# EAGLE design Project_bird_V2.1 (EAGLE 9.6.2)

## Sheet 1 of 2
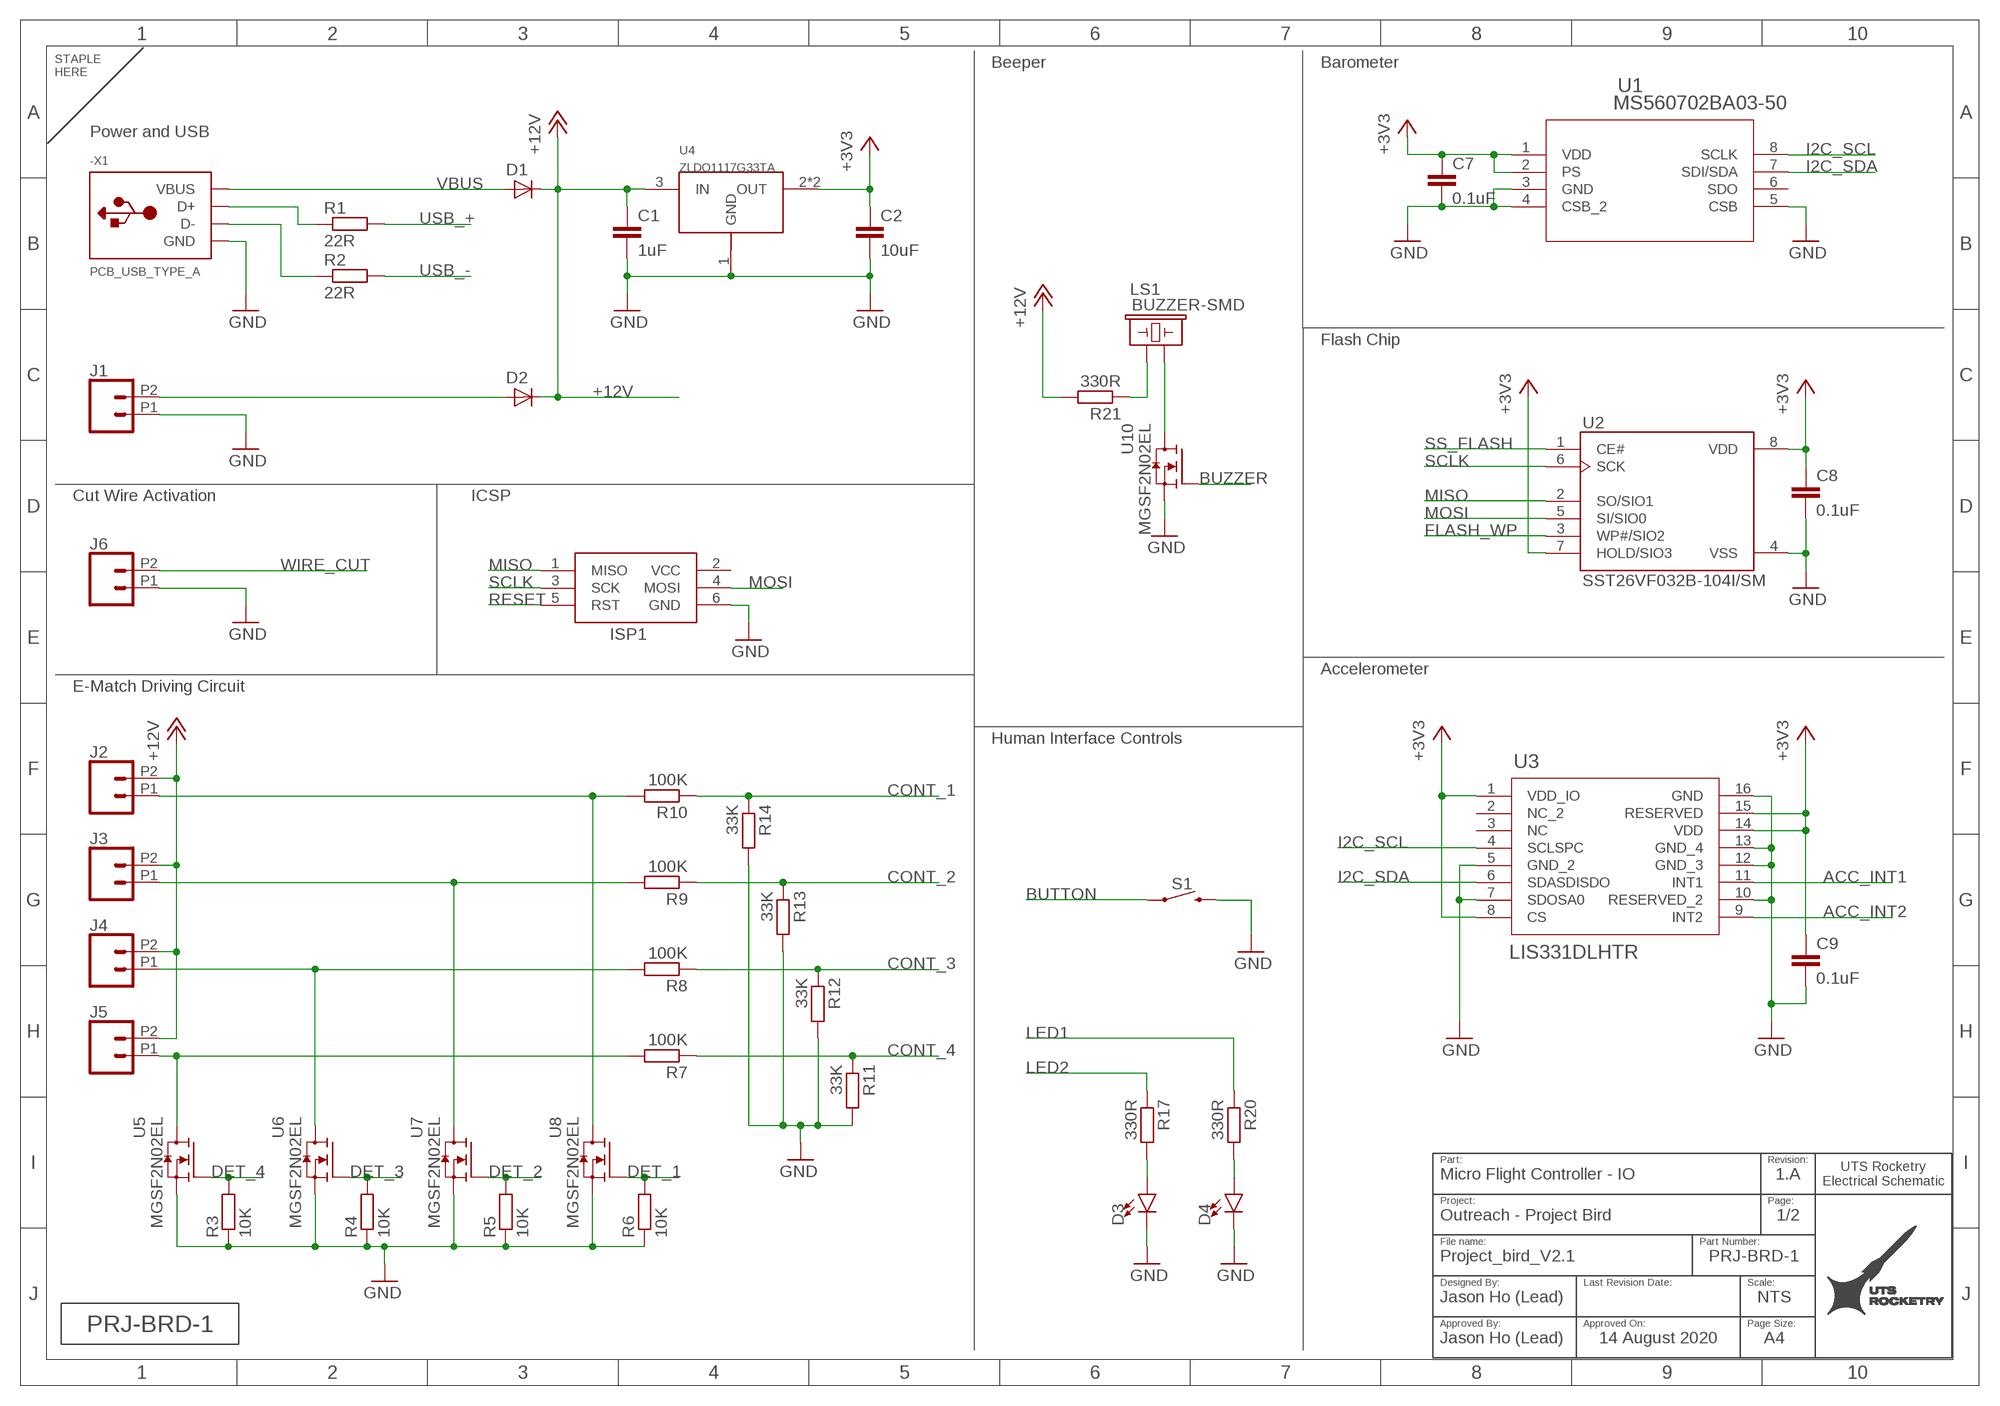
[diagram p0: schematic, sheet 1]
U$1 (TITLE_BLOCK_PAGE_TEMPLATE_A4): APPROVER: Jason Ho (Lead); APPROVE_DATE: 14 August 2020; DESIGNER: Jason Ho (Lead); PART_NAME: Micro Flight Controller - IO; PART_NO: PRJ-BRD-1; PG_SIZE: A4; PROJECT_NAME: Outreach - Project Bird; REV: 1.A; SCALE: NTS

### Parts
-X1  PCB_USB_TYPE_A  [USB_TYPE-A]
C1  1uF  CAP_0805  [C0805K]
C2  10uF  CAP_0805  [C0805K]
C7  0.1uF  CAP_0805  [C0805K]
C8  0.1uF  CAP_0805  [C0805K]
C9  0.1uF  CAP_0805  [C0805K]
D1  1A  DIODESOD-323F  [SOD-323F]
D2  1A  DIODESOD-323F  [SOD-323F]
D3  LED3MM-RED  [LED_3MM]
D4  LED3MM-YELLOW  [LED_3MM]
ISP1  AVRISP-6  [AVRISP]
J1  CONN_022.54MM_SCREWTERM  [1X02_2.54_SCREWTERM]
J2  CONN_022.54MM_SCREWTERM  [1X02_2.54_SCREWTERM]
J3  CONN_022.54MM_SCREWTERM  [1X02_2.54_SCREWTERM]
J4  CONN_022.54MM_SCREWTERM  [1X02_2.54_SCREWTERM]
J5  CONN_022.54MM_SCREWTERM  [1X02_2.54_SCREWTERM]
J6  CONN_022.54MM_SCREWTERM  [1X02_2.54_SCREWTERM]
LS1  BUZZER-SMD  [BUZZER-CCV]
R1  22R  RES_0805  [R0805]
R2  22R  RES_0805  [R0805]
R3  10K  RES_0805  [R0805]
R4  10K  RES_0805  [R0805]
R5  10K  RES_0805  [R0805]
R6  10K  RES_0805  [R0805]
R7  100K  RES_0805  [R0805]
R8  100K  RES_0805  [R0805]
R9  100K  RES_0805  [R0805]
R10  100K  RES_0805  [R0805]
R11  33K  RES_0805  [R0805]
R12  33K  RES_0805  [R0805]
R13  33K  RES_0805  [R0805]
R14  33K  RES_0805  [R0805]
R17  330R  RES_0805  [R0805]
R20  330R  RES_0805  [R0805]
R21  330R  RES_0805  [R0805]
S1  MOMENTARY-SWITCH-SPST  [TACTILE_SWITCH_PTH_6.0MM]
U1  MS560702BA03-50  [SON8_MS5611]
U2  SST26VF032B-104I/SM  [SOIC127P794X203-8N]
U3  LIS331DLHTR  [LGA-16_3X3X1MM]
U4  ZLDO1117G33TA  [SOT223]
U5  MGSF2N02EL  [SOT-23-3]
U6  MGSF2N02EL  [SOT-23-3]
U7  MGSF2N02EL  [SOT-23-3]
U8  MGSF2N02EL  [SOT-23-3]
U10  MGSF2N02EL  [SOT-23-3]

### Nets
+3V3: C2.1 C7.1 C8.1 C9.1 U1.1(VDD) U1.2(PS) U2.7(HOLD/SIO3) U2.8(VDD) U3.1(VDD_IO) U3.8(CS) U3.14(VDD) U3.15(RESERVED) U4.2(OUT) U4.4(OUT) ; also sheet 2
+12V: C1.1 D1.C D2.C J2.P2 J3.P2 J4.P2 J5.P2 R21.2 U4.3(IN)
ACC_INT1: U3.11(INT1) ; also sheet 2
ACC_INT2: U3.9(INT2) ; also sheet 2
BUTTON: S1.1 S1.2 ; also sheet 2
BUZZER: U10.1(G) ; also sheet 2
CONT_1: R10.1 R14.1 ; also sheet 2
CONT_2: R9.1 R13.1 ; also sheet 2
CONT_3: R8.1 R12.1 ; also sheet 2
CONT_4: R7.1 R11.1 ; also sheet 2
DET_1: R6.2 U8.1(G) ; also sheet 2
DET_2: R5.2 U7.1(G) ; also sheet 2
DET_3: R4.2 U6.1(G) ; also sheet 2
DET_4: R3.2 U5.1(G) ; also sheet 2
FLASH_WP: U2.3(WP#/SIO2) ; also sheet 2
GND: -X1.GND C1.2 C2.2 C7.2 C8.2 C9.2 D3.K(C) D4.K(C) ISP1.6(GND) J1.P1 J6.P1 R3.1 R4.1 R5.1 R6.1 R11.2 R12.2 R13.2 R14.2 S1.3 S1.4 U1.3(GND) U1.4(CSB_2) U1.5(CSB) U2.4(VSS) U3.5(GND_2) U3.7(SDOSA0) U3.10(RESERVED_2) U3.12(GND_3) U3.13(GND_4) U3.16(GND) U4.1(GND) U5.2(S) U6.2(S) U7.2(S) U8.2(S) U10.2(S) ; also sheet 2
I2C_SCL: U1.8(SCLK) U3.4(SCLSPC) ; also sheet 2
I2C_SDA: U1.7(SDI/SDA) U3.6(SDASDISDO) ; also sheet 2
LED1: R20.1 ; also sheet 2
LED2: R17.1 ; also sheet 2
MISO: ISP1.1(MISO) U2.2(SO/SIO1) ; also sheet 2
MOSI: ISP1.4(MOSI) U2.5(SI/SIO0) ; also sheet 2
N$1: D2.A J1.P2
N$2: D3.A R17.2
N$3: -X1.D+ R1.1
N$4: D4.A R20.2
N$5: -X1.D- R2.1
N$6: LS1.- U10.3(D)
N$7: LS1.+ R21.1
N$10: J5.P1 R7.2 U5.3(D)
N$11: J4.P1 R8.2 U6.3(D)
N$12: J3.P1 R9.2 U7.3(D)
N$13: J2.P1 R10.2 U8.3(D)
RESET: ISP1.5(RST) ; also sheet 2
SCLK: ISP1.3(SCK) U2.6(SCK) ; also sheet 2
SS_FLASH: U2.1(CE#) ; also sheet 2
USB_+: R1.2 ; also sheet 2
USB_-: R2.2 ; also sheet 2
VBUS: -X1.VBUS D1.A ; also sheet 2
WIRE_CUT: J6.P2 ; also sheet 2
Unconnected: U1.6(SDO) U3.2(NC_2) U3.3(NC)

### Notes on the sheet
- Beeper | Barometer
- Power and USB
- Flash Chip
- Cut Wire Activation | ICSP
- Accelerometer
- E-Match Driving Circuit
- Human Interface Controls

## Sheet 2 of 2
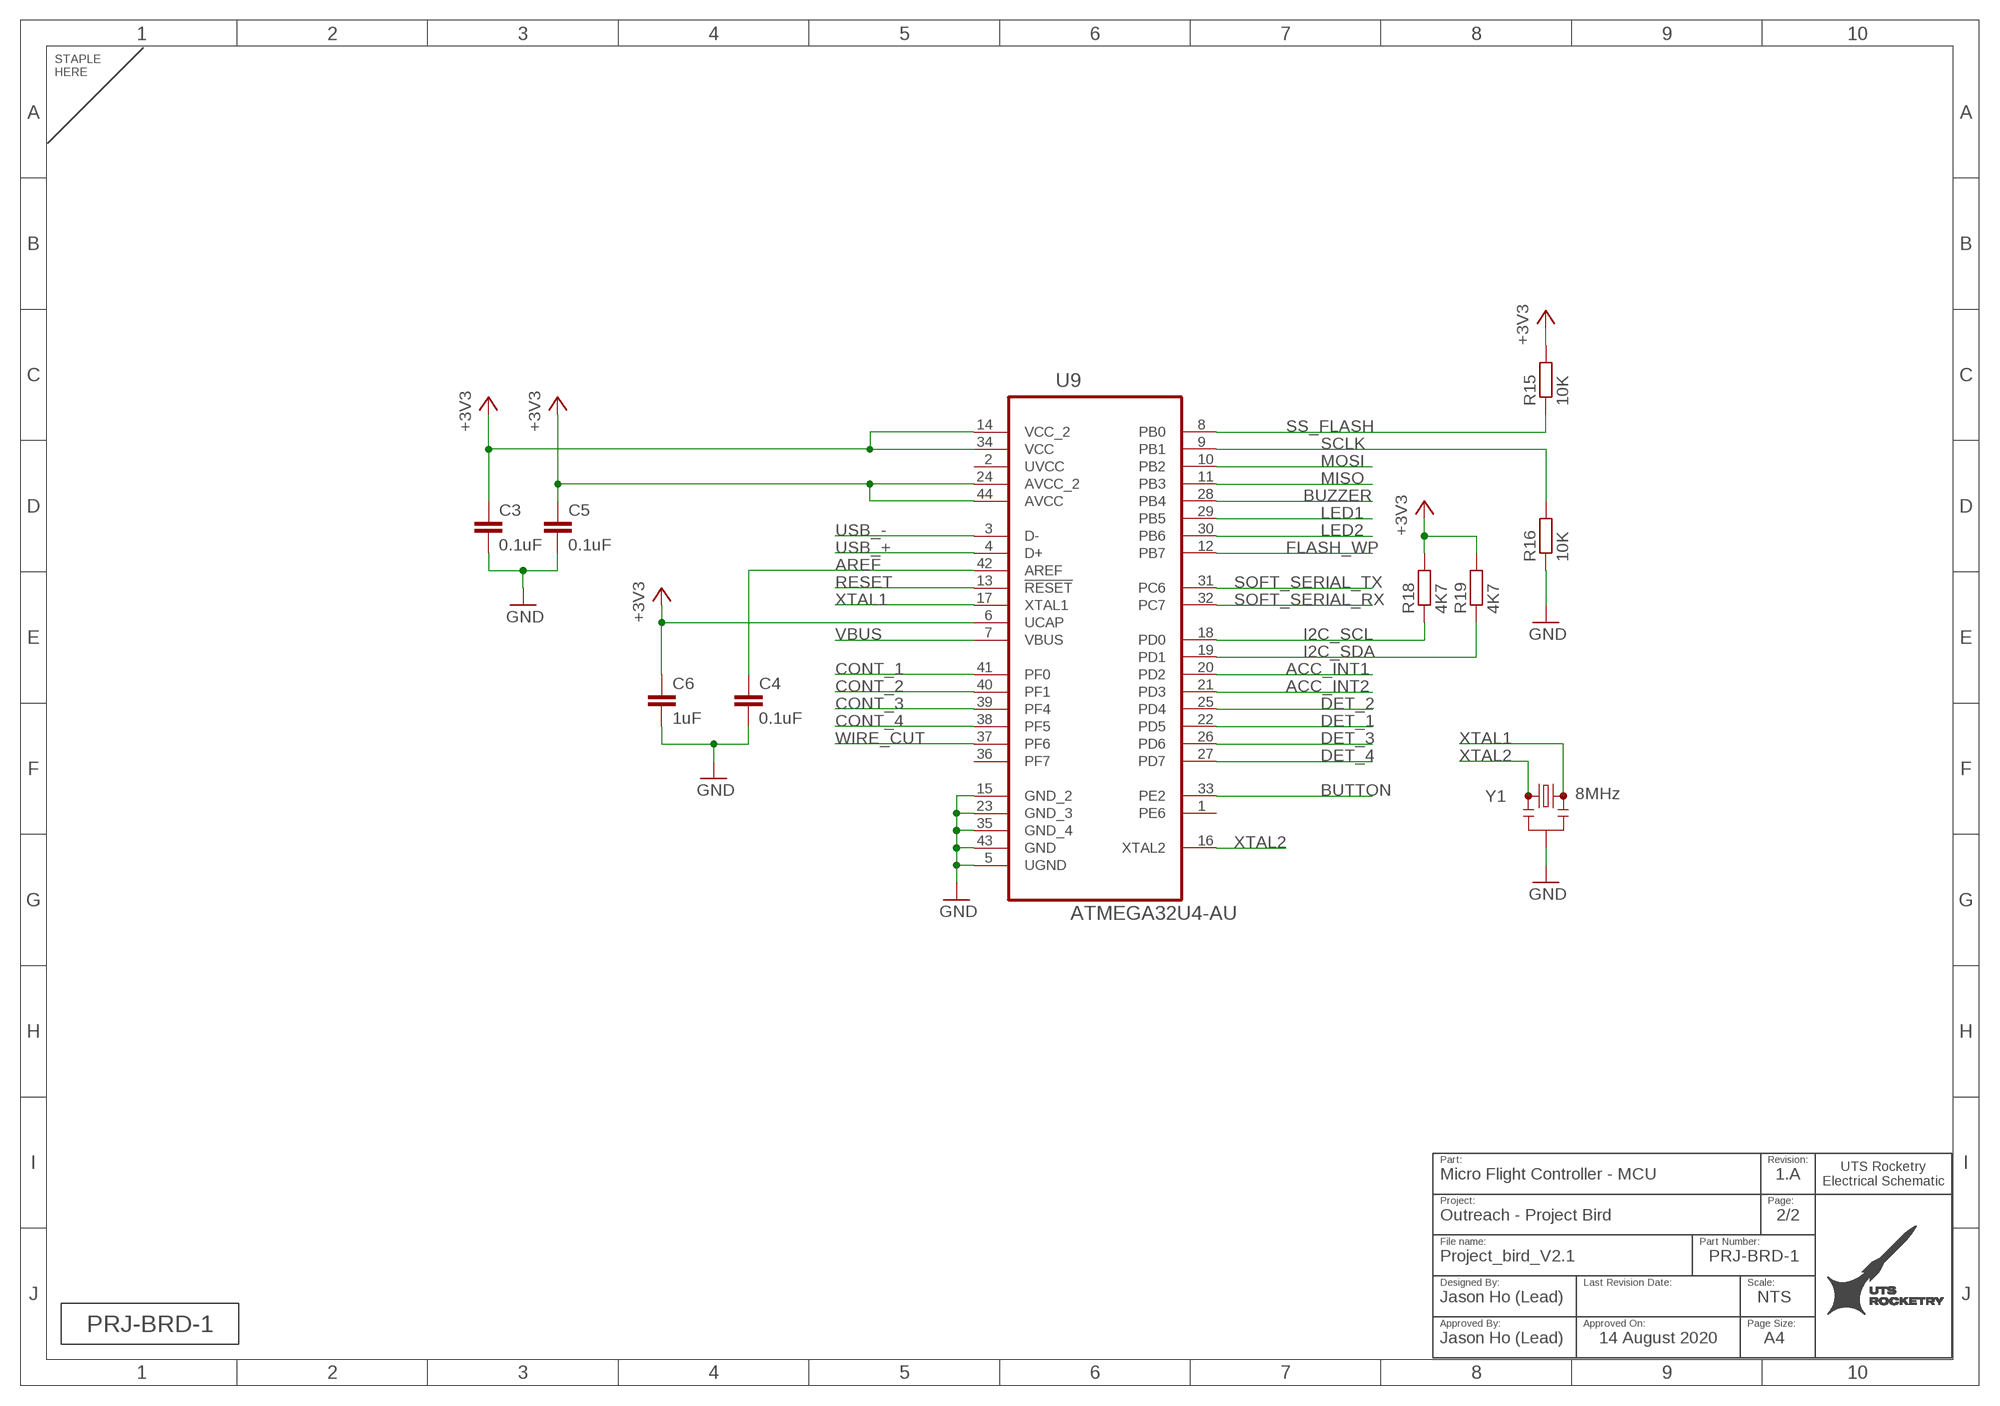
[diagram p1: schematic, sheet 2]
U$2 (TITLE_BLOCK_PAGE_TEMPLATE_A4): APPROVER: Jason Ho (Lead); APPROVE_DATE: 14 August 2020; DESIGNER: Jason Ho (Lead); PART_NAME: Micro Flight Controller - MCU; PART_NO: PRJ-BRD-1; PG_SIZE: A4; PROJECT_NAME: Outreach - Project Bird; REV: 1.A; SCALE: NTS

### Parts
C3  0.1uF  CAP_0805  [C0805K]
C4  0.1uF  CAP_0805  [C0805K]
C5  0.1uF  CAP_0805  [C0805K]
C6  1uF  CAP_0805  [C0805K]
R15  10K  RES_0805  [R0805]
R16  10K  RES_0805  [R0805]
R18  4K7  RES_0805  [R0805]
R19  4K7  RES_0805  [R0805]
U9  ATMEGA32U4-AU  [QFP80P1200X1200X120-44N]
Y1  8MHz  RESONATOR-CSTCE8M00G55-R0  [RESONATOR-SMD-3.2X1.3]

### Nets
+3V3: C3.1 C5.1 C6.1 R15.2 R18.2 R19.2 U9.6(UCAP) U9.14(VCC_2) U9.24(AVCC_2) U9.34(VCC) U9.44(AVCC) ; also sheet 1
ACC_INT1: U9.20(PD2) ; also sheet 1
ACC_INT2: U9.21(PD3) ; also sheet 1
AREF: C4.1 U9.42(AREF)
BUTTON: U9.33(PE2) ; also sheet 1
BUZZER: U9.28(PB4) ; also sheet 1
CONT_1: U9.41(PF0) ; also sheet 1
CONT_2: U9.40(PF1) ; also sheet 1
CONT_3: U9.39(PF4) ; also sheet 1
CONT_4: U9.38(PF5) ; also sheet 1
DET_1: U9.22(PD5) ; also sheet 1
DET_2: U9.25(PD4) ; also sheet 1
DET_3: U9.26(PD6) ; also sheet 1
DET_4: U9.27(PD7) ; also sheet 1
FLASH_WP: U9.12(PB7) ; also sheet 1
GND: C3.2 C4.2 C5.2 C6.2 R16.1 U9.5(UGND) U9.15(GND_2) U9.23(GND_3) U9.35(GND_4) U9.43(GND) Y1.2 ; also sheet 1
I2C_SCL: R18.1 U9.18(PD0) ; also sheet 1
I2C_SDA: R19.1 U9.19(PD1) ; also sheet 1
LED1: U9.29(PB5) ; also sheet 1
LED2: U9.30(PB6) ; also sheet 1
MISO: U9.11(PB3) ; also sheet 1
MOSI: U9.10(PB2) ; also sheet 1
RESET: U9.13(!RESET) ; also sheet 1
SCLK: R16.2 U9.9(PB1) ; also sheet 1
SOFT_SERIAL_RX: U9.32(PC7)
SOFT_SERIAL_TX: U9.31(PC6)
SS_FLASH: R15.1 U9.8(PB0) ; also sheet 1
USB_+: U9.4(D+) ; also sheet 1
USB_-: U9.3(D-) ; also sheet 1
VBUS: U9.7(VBUS) ; also sheet 1
WIRE_CUT: U9.37(PF6) ; also sheet 1
XTAL1: U9.17(XTAL1) Y1.3
XTAL2: U9.16(XTAL2) Y1.1
Unconnected: U9.1(PE6) U9.36(PF7)

## Power pins joined to a net without a drawn wire
UVCC: U9.2(UVCC)
VCC: ISP1.2(VCC)

## Library data of the parts
-X1 = UTS_Rocketry_Main_EAGLE_Library:PCB_USB_TYPE_A
C1-C9 = UTS_Rocketry_Main_EAGLE_Library:CAP_0805
D1 D2 = UTS_Rocketry_Main_EAGLE_Library:DIODE: Diode SMADIODE - SMA Surface Mount Package 20V 1A Schottky Diode Digikey: 641-1014-6-ND DO-1N4148 - Through Hole Small Current Diode SOD-123 20V 1 A (.5mV Vf) Schottky Diode - Digikey: MBRX120TPMSCT-ND SOD-323 10V 570mA (.38mV Vf, 3ns) Schottky Diode - Digikey: ZLLS410CT-ND SOD-523 30V 30mA Schottky Diode (RB751S-40TE61) - Digikey: RB751S-40TE61CT-ND SOT23-R/W - SOT23 Package (R = Solder Paste/Reflow Ovens, W = Hand-Soldering) BAT54Film 40V 300mA - Digikey: 497-7162-1-ND
D3 = UTS_Rocketry_Main_EAGLE_Library:LED3MM: LED (Generic) Standard schematic elements and footprints for 5mm, 3mm, 1206, and 0603 sized LEDs. Generic LEDs with no color specified.; PROD_ID: DIO-08794
D4 = UTS_Rocketry_Main_EAGLE_Library:LED3MM: LED (Generic) Standard schematic elements and footprints for 5mm, 3mm, 1206, and 0603 sized LEDs. Generic LEDs with no color specified.
ISP1 = UTS_Rocketry_Main_EAGLE_Library:AVRISP: AVR ISP HEADER Standard 6 pin header for AVR programming
J1-J6 = UTS_Rocketry_Main_EAGLE_Library:CONN_02: Multi connection point. Often used as Generic Header-pin footprint for 0.1 inch spaced/style header connections On any of the 0.1 inch spaced packages, you can populate with these: Break Away Headers - Straight <https://www.sparkfun.com/products/116> (PRT-00116) Break Away Male Headers - Right Angle <https://www.sparkfun.com/products/553> (PRT-00553) Female Headers <https://www.sparkfun.com/products/115> (PRT-00115) Break Away Headers - Machine Pin <https://www.sparkfun.com/products/117> (PRT-00117) Break Away Female Headers - Swiss Machine Pin <https://www.sparkfun.com/products/743> (PRT-00743) For SCREWTERMINALS and SPRING TERMINALS visit here: Screw Terimnals on SparkFun.com <https://www.sparkfun.com/search/results?term=Screw+Terminals> (5mm/3.5mm/2.54mm spacing) This device is also useful as a general connection point to wire up your design to another part of your project. Our various solder wires solder well into these plated through hole pads. Hook-Up Wire - Assortment (Stranded, 22 AWG) <https://www.sparkfun.com/products/11375> (PRT-11375) Hook-Up Wire - Assortment (Solid Core, 22 AWG) <https://www.sparkfun.com/products/11367> (PRT-11367) View the entire wire category on our website here <https://www.sparkfun.com/categories/141> Special notes: Molex polarized connector foot print use with: PRT-08233 with associated crimp pins and housings. 2.54_SCREWTERM for use with PRT-10571. 3.5mm Screw Terminal footprints for PRT-08084 5mm Screw Terminal footprints for use with PRT-08432
LS1 = UTS_Rocketry_Main_EAGLE_Library:BUZZER: Buzzer Small round buzzers that operate around the audible 2kHz range. You can use these as speakers to create simple music or user interfaces. Variant Overview: PTH - Mini Speaker - PC Mount 12mm 2.048kHz <https://www.sparkfun.com/products/7950> PTH_KIT - Mini Speaker - PC Mount 12mm 2.048kHz <https://www.sparkfun.com/products/7950> KIT simplifies soldering by adding stop mask to one side of the pads. PTH_NO_SILK - Mini Speaker - PC Mount 12mm 2.048kHz <https://www.sparkfun.com/products/7950> No silkscreen indicator of buzzer outline. PTH_KIT_NO_SILK - Mini Speaker - PC Mount 12mm 2.048kHz <https://www.sparkfun.com/products/7950> KIT package w/o silkscreen SMD - Buzzer Audio Magnetic (CCV-084B16) SMD buzzer used on, e.g. the LilyPad Buzzer <https://www.sparkfun.com/products/8463> and RFID USB Reader <https://www.sparkfun.com/products/9963>. SMD_KIT - Buzzer Audio Magnetic (CCV-084B16) SMD Buzzer with elongated pins to make soldering easier. Used on the SparkFun Simon Says - Surface Mount Soldering Kit <https://www.sparkfun.com/products/10935>.; PROD_ID: COMP-08568
R1-R21 = UTS_Rocketry_Main_EAGLE_Library:RES_0805
S1 = UTS_Rocketry_Main_EAGLE_Library:MOMENTARY-SWITCH-SPST: Momentary Switch (Pushbutton) - SPST Normally-open (NO) SPST momentary switches (buttons, pushbuttons). Variants PTH-12MM - 12mm square, through-hole Momentary Pushbutton Switch - 12mm Square <https://www.sparkfun.com/products/9190> (COM-09190) PTH-6.0MM, PTH-6.0MM-KIT - 6.0mm square, through-hole Mini Pushbutton Switch <https://www.sparkfun.com/products/97> (COM-00097) KIT package intended for soldering kit's - only one side of pads' copper is exposed. PTH-RIGHT-ANGLE-KIT - Right-angle, through-hole Right Angle Tactile Button <https://www.sparkfun.com/products/10791> - Used on SparkFun BigTime Watch Kit <https://www.sparkfun.com/products/11734> SMD-12MM - 12mm square, surface-mount Tactile Button - SMD (12mm) <https://www.sparkfun.com/products/12993> (COM-12993) Used on SparkFun PicoBoard <https://www.sparkfun.com/products/11888> SMD-4.5MM - 4.5mm Square Trackball Switch Used on SparkFun Blackberry Trackballer Breakout <https://www.sparkfun.com/products/13169> SMD-4.6MMX2.8MM - 4.60mm x 2.80mm, surface mount Used on SparkFun SAMD21 Mini Breakout <https://www.sparkfun.com/products/13664> SMD-5.2MM, SMD-5.2-REDUNDANT - 5.2mm square, surface-mount Mini Pushbutton Switch - SMD <https://www.sparkfun.com/products/8720> (COM-08720) Used on Arduino Pro Mini <https://www.sparkfun.com/products/11114> REDUNDANT package connects both switch circuits together SMD-6.0X3.5MM - 6.0 x 3.5mm, surface mount Momentary Reset Switch SMD <https://www.sparkfun.com/products/8229> (COM-08229) SMD-6.2MM-TALL - 6.2mm square, surface mount Tactile Button - SMD (6mm) <https://www.sparkfun.com/products/12992> Used on SparkFun Digital Sandbox <https://www.sparkfun.com/products/12651> SMD-RIGHT-ANGLE - Right-angle, surface mount Used on SparkFun Block for Intel® Edison - Arduino <https://www.sparkfun.com/products/13036>
U1 = UTS_Rocketry_Main_EAGLE_Library:MS560702BA03-50; BUILT_BY: EMA_UL_Team; COPYRIGHT: Copyright (C) 2016 Accelerated Designs. All rights reserved; DESCRIPTION: MS5607-02BA SS CAP ALTIMETER T&R; MANUFACTURER_PART_NUMBER: MS560702BA03-50; OUTPUT-SPAN: 24 bit ADC; PACKAGE: Surface Mountable; PRODUCT_DESCRIPTION: MS5607-02BA SS CAP ALTIMETER T&R; PRODUCT_TYPE: -; SENSOR_TYPE: Digital Pressure and Altimeter Sensor Modules; SUPPLY_VOLTAGE: 1.5  3.6; TE_PART_NUMBER: MS560702BA03-50; VENDOR: TE Connectivity
U2 = UTS_Rocketry_Main_EAGLE_Library:SST26VF032B-104I/SM: SST26VF032 Series 32 Mb (4M x 8) 3.6 V Serial Quad I/O Flash Memory - SOIJ-8; AVAILABILITY: Unavailable; DESCRIPTION: FLASH Memory IC 32Mb (4M x 8) SPI - Quad I/O 104MHz 8-SOIJ; MF: Microchip; MP: SST26VF032B-104I/SM; PACKAGE: SO-8 Microchip; PRICE: None
U3 = UTS_Rocketry_Main_EAGLE_Library:LIS331DLHTR; BUILT_BY: EMA_UL_Team; MANUFACTURER_PART_NUMBER: LIS331DLHTR; VENDOR: STMicroelectronics
U4 = UTS_Rocketry_Main_EAGLE_Library:ZLDO1117
U5-U8 U10 = UTS_Rocketry_Main_EAGLE_Library:MGSF2N02EL
U9 = UTS_Rocketry_Main_EAGLE_Library:ATMEGA32U4-AU: 8-bit Microcontroller with ISP Flash and USB Controller Buy Part <https://snapeda.com/parts/ATMEGA32U4-AU/Microchip%20Technology%20/%20Atmel/view-part/?ref=eda>; AVAILABILITY: Good; DESCRIPTION: 8-bit Microcontrollers - MCU AVR USB 32K FLASH INDUSTRIAL; DIGIKEY-PURCHASE-URL: https://snapeda.com/shop?store=DigiKey&id=4834843; MF: Microchip Technology / Atmel; MOUSER-PURCHASE-URL: https://snapeda.com/shop?store=Mouser&id=4834843; MP: ATMEGA32U4-AU; PACKAGE: None; PRICE: None
Y1 = UTS_Rocketry_Main_EAGLE_Library:RESONATOR-CSTCE: 8MHz Resonator Digikey Example <http://www.digikey.com/product-detail/en/murata-electronics-north-america/CSTCE10M0G55-R0/490-1196-1-ND/584633> Frequency: 8MHz Frequency Stability: ±0.2% Frequency Tolerance: ±0.5% Capacitance: 33pF SparkFun Products Arduino Pro Mini 328- 3.3V/8MHz <https://www.sparkfun.com/products/11114> SparkFun Digital Sandbox <https://www.sparkfun.com/products/12651>; PROD_ID: XTAL-08895

## Board
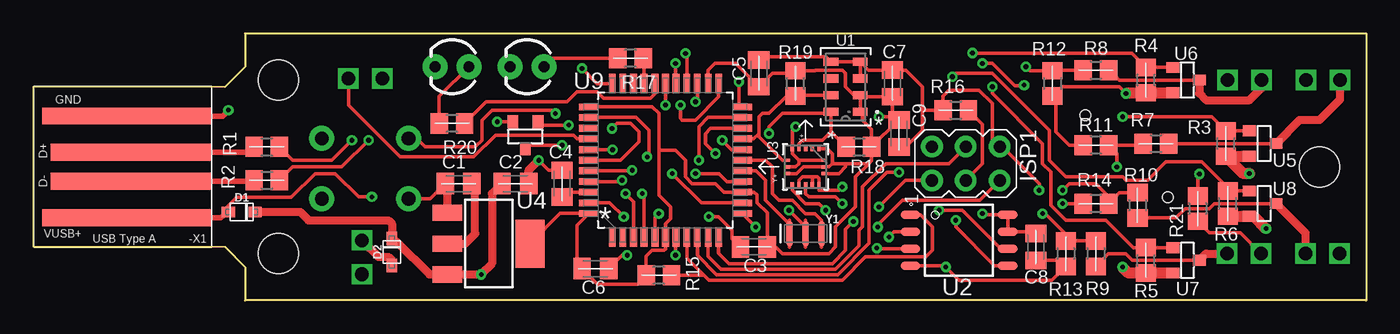
[diagram p2: board, top side]
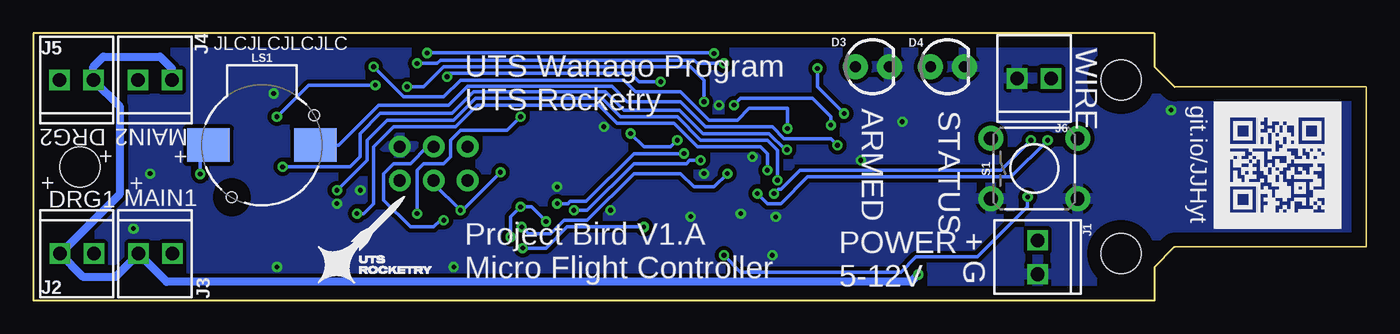
[diagram p3: board, bottom side, seen from below]

Size 99.86 x 20 mm. Coordinates in mm from the lower left corner, seen from the top.
Outline: 14.37,16 15.87,17.5 15.87,20 99.86,20 99.86,0 15.87,0 15.87,2.5 14.37,4
Copper layers (1*16): Top 0.035mm / dielectric 1.5mm / Bottom 0.035mm
Design rules "default": minimum track width 6mil, minimum drill 0.35mm, track to track 6mil, track to pad 6mil, pad to pad 6mil, via to via 6mil, smd to smd 6mil, copper to edge 40mil, drill to drill 6mil, minimum pad ring 10mil, minimum via ring 8mil, stop-mask expansion 4mil, vias tented up to drill 0mil, thermal gap 10mil
Holes 3 mm at 18.37,16.5 18.37,3.5 96.36,10

### Footprints (pad centres in the part's own frame; a part is rotated, then mirrored left to right if it is on the bottom)
USB_TYPE-A = smd 1.27 x 12.065: D+ 1.079,6.032; D- -1.079,6.032 | smd 1.27 x 12.7: GND 3.81,6.35; VBUS -3.81,6.35
C0805K = smd 1.3 x 1.6: 1 -1,0; 2 1,0
SOD-323F = smd 1 x 0.8: A -1,0; C 1,0
LED_3MM = drill 0.813 pad 1.88: A -1.27,0; K 1.27,0
AVRISP = drill 0.9 pad 1.626: 1 -1.27,2.54; 2 1.27,2.54; 3 -1.27,0; 4 1.27,0; 5 -1.27,-2.54; 6 1.27,-2.54
1X02_2.54_SCREWTERM = drill 1.016 square: P1 2.54,0; P2 0,0
BUZZER-CCV = smd 3.2 x 2.5: + 4,0; - -4,0 | hole 0.8: -3.9,-2.25; 2.25,3.9
R0805 = smd 1.3 x 1.5: 1 -0.95,0; 2 0.95,0
TACTILE_SWITCH_PTH_6.0MM = drill 1.016 pad 1.88: 1 -3.251,2.261; 2 3.251,2.261; 3 -3.251,-2.261; 4 3.251,-2.261
SON8_MS5611 = smd 1.092 x 0.61: 1 -1.1,1.875; 2 -1.1,0.625; 3 -1.1,-0.625; 4 -1.1,-1.875; 5 1.1,-1.875; 6 1.1,-0.625; 7 1.1,0.625; 8 1.1,1.875
SOIC127P794X203-8N = smd 1.5 x 0.65: 1 -3.65,1.905; 2 -3.65,0.635; 3 -3.65,-0.635; 4 -3.65,-1.905; 5 3.65,-1.905; 6 3.65,-0.635; 7 3.65,0.635; 8 3.65,1.905
LGA-16_3X3X1MM = smd 0.356 x 0.254: 1 -1.346,1; 2 -1.346,0.5; 3 -1.346,0; 4 -1.346,-0.5; 5 -1.346,-1; 9 1.346,-1; 10 1.346,-0.5; 11 1.346,0; 12 1.346,0.5; 13 1.346,1 | smd 0.254 x 0.356: 6 -0.5,-1.346; 7 0,-1.346; 8 0.5,-1.346; 14 0.5,1.346; 15 0,1.346; 16 -0.5,1.346
SOT223 = smd 1.219 x 2.235: 1 -2.311,-3.099; 2 0,-3.099; 3 2.311,-3.099 | smd 3.6 x 2.2: 4 0,3.099
SOT-23-3 = smd 0.802 x 0.972: 1 -0.95,-1; 2 0.95,-1; 3 0,1
QFP80P1200X1200X120-44N = smd 1.473 x 0.508: 1 -5.74,3.988; 2 -5.74,3.2; 3 -5.74,2.388; 4 -5.74,1.6; 5 -5.74,0.787; 6 -5.74,0; 7 -5.74,-0.787; 8 -5.74,-1.6; 9 -5.74,-2.388; 10 -5.74,-3.2; 11 -5.74,-3.988; 23 5.74,-3.988; 24 5.74,-3.2; 25 5.74,-2.388; 26 5.74,-1.6; 27 5.74,-0.787; 28 5.74,0; 29 5.74,0.787; 30 5.74,1.6; 31 5.74,2.388; 32 5.74,3.2; 33 5.74,3.988 | smd 0.508 x 1.473: 12 -3.988,-5.74; 13 -3.2,-5.74; 14 -2.388,-5.74; 15 -1.6,-5.74; 16 -0.787,-5.74; 17 0,-5.74; 18 0.787,-5.74; 19 1.6,-5.74; 20 2.388,-5.74; 21 3.2,-5.74; 22 3.988,-5.74; 34 3.988,5.74; 35 3.2,5.74; 36 2.388,5.74; 37 1.6,5.74; 38 0.787,5.74; 39 0,5.74; 40 -0.787,5.74; 41 -1.6,5.74; 42 -2.388,5.74; 43 -3.2,5.74; 44 -3.988,5.74
RESONATOR-SMD-3.2X1.3 = smd 0.45 x 1.905: 1 -1.2,0; 2 0,0; 3 1.2,0

### Placement (x,y rotation side)
-X1  13.37,10 90 top
C1  36.12,8.75 0 top
C2  31.87,8.75 180 top
C3  53.99,4 180 top
C4  39.62,8.75 90 top
C5  54.37,17 90 top
C6  42.12,2.38 0 top
C7  64.36,16.25 90 top
C8  75.11,4 270 top
C9  64.86,12.5 270 top
D1  15.62,6.62 0 top
D2  26.87,3.62 90 top
D3  36.99,17.5 0 bottom
D4  31.37,17.5 0 bottom
ISP1  69.86,10.25 90 top
J1  24.62,4.5 270 bottom
J2  97.86,3.5 0 bottom
J3  91.99,3.5 0 bottom
J4  89.49,16.5 180 bottom
J5  95.36,16.5 180 bottom
J6  23.62,16.62 180 bottom
LS1  82.74,11.62 180 bottom
R1  17.49,11.5 0 top
R2  17.49,9 0 top
R3  89.36,11.75 90 top
R4  83.36,16.5 90 top
R5  83.36,3 90 top
R6  89.49,7.25 90 top
R7  84.11,11.75 0 top
R8  79.61,17.25 0 top
R9  79.61,3.5 270 top
R10  82.74,7.12 270 top
R11  79.61,11.62 180 top
R12  76.36,16.25 270 top
R13  77.36,3.5 270 top
R14  79.61,7.25 180 top
R15  46.87,1.88 180 top
R16  69.11,14.25 0 top
R17  44.74,18.12 180 top
R18  61.87,11.5 0 top
R19  57.12,16.25 90 top
R20  31.37,13.25 180 top
R21  87.24,6.88 270 top
S1  24.87,9.87 0 bottom
U1  60.87,16 180 top
U2  69.36,4.5 0 top
U3  57.87,10 270 top
U4  34.12,4.25 270 top
U5  92.11,11.75 270 top
U6  86.36,16.5 270 top
U7  86.36,3 270 top
U8  92.11,7.25 270 top
U9  47.37,10.5 90 top
U10  36.87,12.38 180 top
Y1  57.87,5 0 top

### Tracks (layer width: path | path; a pad name or v marks a point on that pad's centre or on a via)
+3V3  (via drill 0.35)
  Top 0.254: 59.87,10.25 59.87,11 59.52,11.35 U3.1 | U1.2 U1.1 62.12,13.97 62.12,13.5 62.82,12.8 R18.2 | 59.87,10.25 59.62,10 U3.15 57.69,10 57.19,9.5 U3.8 | U9.24 50.57,17.25 51.07,17.75 52.62,17.75 C5.1 55.37,17 56.91,17 R19.2 58.57,17.2 58.62,17.25 60.62,17.25 60.87,17 60.87,16 61.49,15.38 U1.2 | U1.2 62.09,15.25 C7.1 64.36,14 64.61,13.75 | R18.2 62.82,10.45 62.62,10.25 | 59.87,10.25 60.87,10.25 | 60.87,10.25 62.62,10.25 | v71.11,6.5 71.21,6.41 U2.8 U2.7 74.98,5.13 C8.1 | 62.62,10.25 61.62,9.25 61.62,7 60.12,5.5 60.12,4 59.62,3.5 56.12,3.5 55.62,4 C3.1 54.99,6.55 54.21,7.33 54.21,7.91 54,8.11 U9.14 51.75,8.11 51.12,8.75 49.37,8.75 48.87,9.25 48.87,10.5 48.12,11.25 46.87,11.25 | v63.37,13.75 64.61,13.75 | 64.61,13.75 C9.1 64.81,13.5 R18.2 | U9.34 41.64,14.5 46.37,14.5 46.87,14 46.87,11.25 | 46.87,11.25 46.87,7.88 47.74,7 47.74,6.12 47.37,5.75 U9.6 47.37,3.85 47.26,3.74 46.37,3.74 45.91,3.29 R15.2 45.26,1.22 42.27,1.22 C6.1 40.74,2.75 40.74,5.63 U9.44 39.49,6.51 39.48,6.51 U4.4 | 60.87,10.25 60.87,10 60.37,9.5 U3.14
  Top 0.61: U4.2 32.37,4.25 33.12,5 33.12,8.5 C2.1
  Bottom 0.254: v71.11,6.5 71.11,9.75 70.61,10.25 69.11,10.25 68.61,10.75 68.61,12 67.86,12.75 64.36,12.75 v63.37,13.75
+12V  (via drill 0.35)
  Top 0.254: R21.2 88.1,5.06 90.43,5.06 J3.P2
  Top 0.61: D1.C 19.99,6.62 20.62,6 26.62,6 26.87,5.75 D2.C 27.21,4.4 29.68,1.94 U4.3 v33.55,1.94 34.37,2.75 34.37,8 C1.1
  Bottom 0.61: J4.P2 89.49,17.38 90.36,18.25 94.61,18.25 95.36,17.5 J5.P2 93.36,14.5 93.36,8 J2.P2 96.11,1.75 93.74,1.75 J3.P2 89.89,1.4 34.1,1.4 v33.55,1.94
ACC_INT1  (via drill 0.35)
  Top 0.254: U9.20 50.75,12.89 50.37,12.5 50.37,11.75 v51.12,11 | U3.11 57.87,8 58.12,7.75 60.12,7.75 v60.62,7.25
  Bottom 0.254: v60.62,7.25 59.8,7.25 59.64,7.41 58.46,7.41 54.87,11 v51.12,11
ACC_INT2  (via drill 0.35)
  Top 0.254: U9.21 50.57,13.7 49.87,13 v49.87,10.5 | U3.9 56.87,8.25 57.87,7.25 58.87,7.25 v59.37,6.75
  Bottom 0.254: v59.37,6.75 58.37,6.75 54.87,10.25 50.94,10.25 50.69,10.5 v49.87,10.5
AREF
  Top 0.254: U9.42 39.98,8.11 C4.1
BUTTON  (via drill 0.35)
  Top 0.254: S1.1 28.73,12.13 29.37,11.5 33.12,11.5 33.62,12 33.62,13.5 34.37,14.25 38.87,14.25 v39.12,14 | U9.33 42.25,16.24 v41.12,17.38
  Bottom 0.254: v41.12,17.38 41.12,16 v39.12,14
BUZZER  (via drill 0.35)
  Top 0.254: U10.1 38.06,13.12 v40.12,13.12 | v47.37,14.62 U9.28
  Bottom 0.254: v40.12,13.12 40.12,13.75 41.49,15.12 46.87,15.12 v47.37,14.62
CONT_1  (via drill 0.35)
  Top 0.254: v77.11,8.25 77.61,8.75 79.61,8.75 80.56,7.8 R14.1 81.39,8.07 R10.1 | v44.12,9 44.02,8.9 U9.41
  Bottom 0.254: v77.11,8.25 74.86,10.5 74.86,12 73.36,13.5 68.36,13.5 66.74,15.12 57.24,15.12 55.87,13.75 51.62,13.75 49.87,12 44.87,12 44.12,11.25 v44.12,9
CONT_2  (via drill 0.35)
  Top 0.254: v75.61,6.5 75.81,6.5 77.36,4.95 R13.1 R9.1 | U9.40 44.83,9.71 v44.87,9.75
  Bottom 0.254: v75.61,6.5 75.11,6.5 74.36,7.25 74.36,11.5 72.86,13 68.24,13 66.61,14.62 57.49,14.62 56.12,13.25 51.87,13.25 50.12,11.5 45.37,11.5 44.87,11 v44.87,9.75
CONT_3  (via drill 0.35)
  Top 0.254: R8.1 76.41,17.25 R12.1 74.66,17.2 v74.36,17.5 | v43.37,12.88 43.74,13.25 44.74,13.25 45.37,12.62 45.37,11.88 43.99,10.5 U9.39
  Bottom 0.254: v74.36,17.5 72.11,15.25 69.11,15.25 67.86,16.5 55.62,16.5 54.74,15.62 51.37,15.62 49.24,13.5 47.12,13.5 46.24,14.38 43.37,14.38 v43.37,12.88
CONT_4  (via drill 0.35)
  Top 0.254: R7.1 83.04,11.62 R11.1 81.19,11 v81.19,10 | v43.4,11.29 U9.38
  Bottom 0.254: v81.19,10 76.11,10 75.36,10.75 75.36,12.5 73.86,14 68.49,14 66.86,15.62 56.99,15.62 55.62,14.25 51.44,14.25 49.69,12.5 44.74,12.5 43.53,11.29 v43.4,11.29
DET_1  (via drill 0.35)
  Top 0.254: U8.1 R6.2 89.49,8.45 87.56,10.38 84.86,10.38 83.49,9 81.87,9 81.63,9.25 77.36,9.25 76.11,10.5 76.11,12.75 71.86,17 69.11,17 v68.86,16.75 | v52.87,16.38 52.87,14.73 U9.22
  Bottom 0.254: v68.86,16.75 68.86,16.88 68.74,17 55.12,17 54.49,16.38 v52.87,16.38
DET_2  (via drill 0.35)
  Top 0.254: U7.1 R5.2 82.41,3.95 80.36,6 77.36,6 76.24,7.12 76.24,9.62 75.61,10.25 75.61,11.75 71.86,15.5 v71.86,16 | v49.62,14.88 49.75,15.01 U9.25
  Bottom 0.254: v71.86,16 70.61,16 69.11,17.5 50.62,17.5 49.62,16.5 v49.62,14.88
DET_3  (via drill 0.35)
  Top 0.254: U6.1 R4.2 82.31,18.5 70.4,18.5 v70.36,18.53 | U9.26 48.97,18.4 v48.87,18.5
  Bottom 0.254: v48.87,18.5 48.87,18.53 v70.36,18.53
DET_4  (via drill 0.35)
  Top 0.254: U5.1 R3.2 88.31,13.75 v81.61,13.75 | v71.11,17.75 71.86,17.75 73.55,16.06 74.18,16.06 v74.24,16.12 | v48.12,17.75 48.12,16.28 U9.27
  Bottom 0.254: v71.11,17.75 69.61,17.75 69.36,18 50.37,18 50.12,17.75 v48.12,17.75 | v74.24,16.12 79.24,16.12 v81.61,13.75
FLASH_WP  (via drill 0.35)
  Top 0.254: U2.3 63.25,3.87 v63.2,3.92 | U9.12 v54.12,5.5
  Bottom 0.254: v63.2,3.92 61.45,3.92 59.87,5.5 v54.12,5.5
GND  (via drill 0.35)
  Top 0.254: R14.2 v77.11,7.25 | U9.5 46.58,6.21 v46.87,6.5 | U9.43 43.19,7.3 v44.24,6.25 | U1.3 U1.4 | U1.4 U1.5 59.39,18.25 54.62,18.25 C5.2 | U9.15 51.97,8.9 51.37,9.5 v49.62,9.5 | Y1.2 57.87,5.5 v56.62,6.75 | U9.23 51.35,15.24 49.62,13.5 48.62,13.5 48.49,13.62 v48.49,14.62 | U1.4 62.59,17.25 C7.2 65.36,17.25 66.61,16 66.61,14.25 | 66.61,14.25 66.61,12.75 65.61,11.75 65.11,11.75 C9.2 | C4.2 38.62,9.75 v37.87,10.5 | U2.4 68.27,2.6 v68.36,2.5 69.36,1.5 76.31,1.5 R13.2 77.11,2.55 76.66,3 C8.2 | 58.37,9.25 U3.12 | 58.37,9.25 58.76,9.25 58.87,9.15 U3.13 58.87,8.25 60.37,8.25 v60.62,8.5 | 58.37,9.25 57.62,9.25 57.37,9 U3.10 | U3.7 57.12,10 57.37,10.25 57.37,10.5 | 57.37,10.5 56.87,11 U3.5 56.87,12.75 v57.12,13 | 57.37,10.5 U3.16 | 66.61,14.25 R16.1 68.16,15.3 68.61,15.75 70.86,15.75 71.86,14.75 71.86,12.06 ISP1.6 72.59,11.52 75.36,8.75 v75.36,8.25 | S1.3 29.73,7.61 C2.2 | C3.2 52.37,4.62 52.37,5.25 51.34,6.28 v50.62,6.28 | U9.35 45.16,13.7 46.12,12.75 46.12,10.88 v45.99,10.75 | U10.2 v34.76,13.38 | C6.2 44.12,3.38 v44.49,3.38 | v81.86,15.5 81.36,16 77.06,16 R12.2 76.61,15.05 76.61,12.62 77.61,11.62 R11.2
  Top 0.406: -X1.GND 14.18,13.81 v14.62,14.25
  Top 0.61: C2.2 31.02,8.6 U4.1 | C1.2 37.12,9.75 v37.87,10.5
  Top 0.813: U7.2 R5.1 82.06,2.05 v81.61,2.5 | R6.1 U8.2 91.44,6.3 v92.36,5.38 | U5.2 R3.1 90.66,9.5 v91.11,9.5 | U6.2 R4.1 83.31,15.5 v81.86,15.5
  pour Bottom (isolate 0.305): 100.36,21.38 -3.63,21.38 -3.63,-0.5 100.36,-0.5
I2C_SCL  (via drill 0.35)
  Top 0.254: R18.1 59.77,12.65 | 59.77,12.65 59.77,14 | 59.77,14 U1.8 | 59.77,12.65 59.12,12 57.62,12 57.37,11.75 U3.4 | v55.12,12.5 55.12,13 56.12,14 59.77,14 | v51.62,12 52.33,11.29 U9.18
  Bottom 0.254: v51.62,12 52.12,11.5 54.12,11.5 v55.12,12.5
I2C_SDA
  Top 0.254: U3.6 56.12,10.5 54.37,12.25 54.37,12.5 | U1.7 57.19,15.38 R19.1 56.41,15.3 55.12,14 54.62,14 54.37,13.75 54.37,12.5 | U9.19 53.97,12.1 54.37,12.5
LED1
  Top 0.254: U9.29 46.58,15.46 46.24,15.12 42.74,15.12 42.24,15.62 40.74,15.62 39.99,14.88 33.94,14.88 R20.1
LED2
  Top 0.254: U9.30 45.77,18.05 R17.1
MISO  (via drill 0.35)
  Top 0.254: U9.11 51.35,3.51 52.12,2.75 59.87,2.75 60.87,3.75 60.87,5.32 v61.46,5.91 | v63.37,7 65.34,8.98 ISP1.1 | v64.11,4.75 64.5,5.13 U2.2
  Bottom 0.254: v61.46,5.91 62.55,7 v63.37,7 64.11,6.25 v64.11,4.75
MOSI  (via drill 0.35)
  Top 0.254: U9.10 50.57,3.3 51.52,2.34 60.12,2.34 61.87,4.09 61.87,5.25 62.12,5.5 62.12,8.5 63.87,10.25 68.59,10.25 ISP1.4 | U2.5 72.02,2.6 69.11,5.5 v69.11,6
  Bottom 0.254: ISP1.4 70.34,11.52 71.61,10.25 72.86,10.25 73.61,9.5 73.61,7.5 71.61,5.5 69.86,5.5 69.36,6 v69.11,6
N$1
  Top 0.61: D2.A 26.87,3 26.62,3.25 25.87,3.25 J1.P2
N$2
  Top 0.254: D3.A 38.88,18.12 R17.2
N$3
  Top 0.254: R1.1 16.12,11.08 16.07,11.08
  Top 0.406: 16.07,11.08 -X1.D+
N$4
  Top 0.254: D4.A 30.41,15.28 R20.2
N$5
  Top 0.406: -X1.D- 16.46,8.92 R2.1
N$6  (via drill 0.35)
  Top 0.254: U10.3 37.12,11.62 v39.62,11.62
  Bottom 0.254: LS1.- 76.99,11.62 73.99,14.62 68.74,14.62 67.33,16.03 56.52,16.03 55.37,14.88 51.37,14.88 49.49,13 44.99,13 44.49,13 43.62,12.12 40.12,12.12 v39.62,11.62
N$7  (via drill 0.35)
  Top 0.254: R21.1 87.24,9.47 v87.36,9.47
  Bottom 0.254: LS1.+ 87.36,11 v87.36,9.47
N$10
  Top 0.254: U5.3 R7.2
  Top 0.61: J5.P1 97.91,15.04 96.36,13.5 94.86,13.5 U5.3
N$11
  Top 0.254: R8.2 80.61,17.25 81.36,16.5 U6.3
  Top 0.61: U6.3 87.36,15.5 87.86,15 91.11,15 92.03,15.91 J4.P1
N$12
  Top 0.254: U7.3 82.36,3 81.86,3.5 80.56,3.5 R9.2
  Top 0.61: U7.3 87.86,3.5 J3.P1
N$13
  Top 0.254: U8.3 88.49,7.25 88.11,6.88 86.32,6.88 85.62,6.17 R10.2
  Top 0.61: J2.P1 95.32,5.04 U8.3
RESET  (via drill 0.35)
  Top 0.254: U9.13 50.07,7.3 v47.87,9.5 | ISP1.5 70.92,7.5 65.11,7.5 63.27,5.66 v63.27,5.5
  Bottom 0.254: v47.87,9.5 48.87,8.5 50.37,8.5 51.37,9.5 54.87,9.5 58.37,6 60.12,6 61.12,5 62.77,5 v63.27,5.5
SCLK  (via drill 0.35)
  Top 0.254: U9.9 49.75,3.36 51.18,1.94 60.28,1.94 62.62,4.27 62.62,8.25 63.96,9.59 v64.86,9.59 | v67.86,6.75 69.61,6.75 72.5,3.87 U2.6 | R16.2 71.11,13.2 71.11,10.23 ISP1.3
  Bottom 0.254: v64.86,9.59 66.85,7.61 67.71,6.75 v67.86,6.75 69.86,8.75 ISP1.3
SS_FLASH
  Top 0.254: U2.1 66.46,6.41 67.36,5.5 67.36,3.75 66.86,3.25 62.37,3.25 60.62,1.5 50.62,1.5 50.24,1.88 | R15.1 50.24,1.88 | U9.8 48.97,3.15 50.24,1.88
USB_+  (via drill 0.35)
  Top 0.254: R1.2 19.44,10.5 22.37,10.5 v23.87,12 | U9.4 45.77,7.85 v45.62,8
  Bottom 0.254: v45.62,8 44.87,7.25 43.87,7.25 41.87,9.25 26.62,9.25 v23.87,12
USB_-  (via drill 0.35)
  Top 0.254: R2.2 19.44,10 23.12,10 v25.12,12 | U9.3 44.98,7.39 v44.37,8
  Bottom 0.254: v44.37,8 44.02,8.34 43.84,8.34 42.44,9.75 27.37,9.75 v25.12,12
VBUS  (via drill 0.35)
  Top 0.254: v25.37,7.75 24.37,7.75 22.62,9.5 21.11,9.5 19.33,7.72 15.24,7.72 14.46,6.95 D1.A | v48.12,3.38 48.12,4.72 U9.7
  Top 0.406: D1.A 14.03,6.19 -X1.VBUS
  Bottom 0.254: v25.37,7.75 25.37,7 29.12,3.25 33.74,3.25 34.87,2.12 46.87,2.12 v48.12,3.38
WIRE_CUT
  Top 0.254: U9.37 40.74,12.1 40.47,12.38 34.62,12.38 32.99,10.75 27.49,10.75 23.62,14.62 J6.P2
XTAL1
  Top 0.254: U9.17 54.87,10.5 55.37,10 55.37,8 55.87,7.5 56.87,7.5 57.87,6.5 58.57,6.5 59.07,6 Y1.3
XTAL2
  Top 0.254: U9.16 54.15,9.71 54.87,9 54.87,7.5 56.66,5.7 Y1.1

### Text on the board
tPlace: * | *
bPlace: WIRE | git.io/JJHyt | STATUS | ARMED | MAIN2 | DRG2 | + | + | + | + | MAIN1 | DRG1 | + G | UTS Wanago Program / UTS Rocketry / / / / Project Bird V1.A / Micro Flight Controller | POWER / 5-12V
bNames: JLCJLCJLCJLC